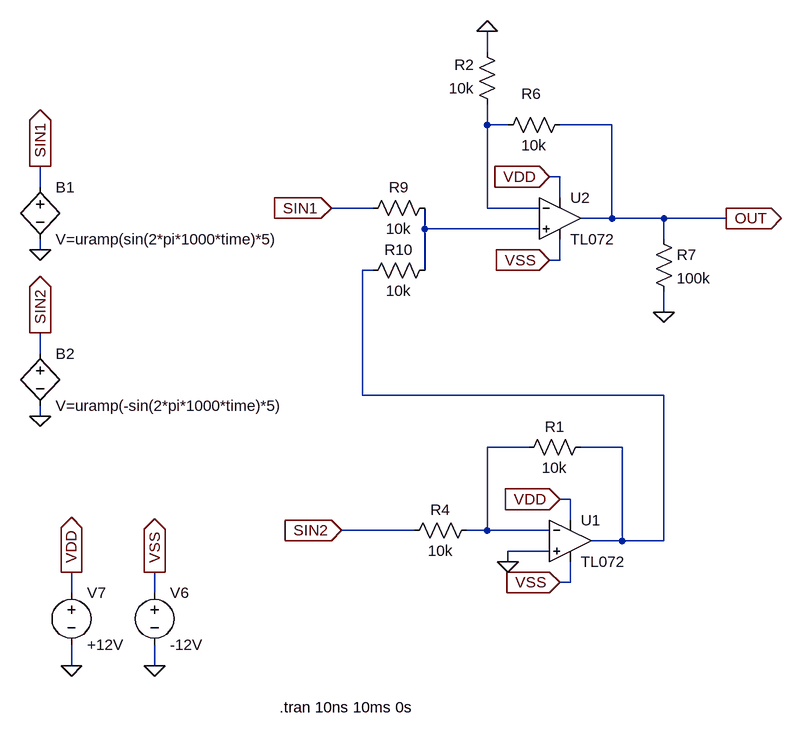
[diagram p0: schematic phr-eurpi-ext-p-p-inv-n-sum-non-inv.asc]
phr-eurpi-ext-p-p-inv-n-sum-non-inv.asc, the LTspice schematic file:
Version 4
SHEET 1 1100 680
WIRE 336 -512 336 -544
WIRE 336 -400 336 -432
WIRE 368 -400 336 -400
WIRE 528 -400 448 -400
WIRE 448 -320 432 -320
WIRE -352 -304 -352 -336
WIRE 448 -288 448 -320
WIRE 160 -272 96 -272
WIRE 336 -272 336 -400
WIRE 416 -272 336 -272
WIRE 528 -256 528 -400
WIRE 528 -256 480 -256
WIRE 608 -256 528 -256
WIRE 704 -256 608 -256
WIRE 240 -240 240 -272
WIRE 416 -240 240 -240
WIRE 608 -224 608 -256
WIRE -352 -208 -352 -224
WIRE 448 -192 448 -224
WIRE 448 -192 432 -192
WIRE 160 -176 144 -176
WIRE 240 -176 240 -240
WIRE 608 -112 608 -144
WIRE -352 -48 -352 -80
WIRE 144 16 144 -176
WIRE 608 16 144 16
WIRE -352 48 -352 32
WIRE 400 96 336 96
WIRE 544 96 480 96
WIRE 464 176 448 176
WIRE 464 208 464 176
WIRE 224 224 112 224
WIRE 336 224 336 96
WIRE 336 224 304 224
WIRE 432 224 336 224
WIRE 544 240 544 96
WIRE 544 240 496 240
WIRE 608 240 608 16
WIRE 608 240 544 240
WIRE 432 256 368 256
WIRE 368 272 368 256
WIRE 464 304 464 272
WIRE 464 304 448 304
WIRE -304 320 -304 288
WIRE -176 320 -176 288
WIRE -304 432 -304 400
WIRE -176 432 -176 400
FLAG -176 432 0
FLAG -304 432 0
FLAG 448 304 VSS
IOPIN 448 304 In
FLAG 448 176 VDD
IOPIN 448 176 In
FLAG -304 288 VDD
IOPIN -304 288 Out
FLAG -176 288 VSS
IOPIN -176 288 Out
FLAG 704 -256 OUT
IOPIN 704 -256 Out
FLAG 608 -112 0
FLAG 432 -192 VSS
IOPIN 432 -192 In
FLAG 432 -320 VDD
IOPIN 432 -320 In
FLAG 336 -544 0
FLAG -352 -336 SIN1
IOPIN -352 -336 Out
FLAG -352 -80 SIN2
IOPIN -352 -80 Out
FLAG 96 -272 SIN1
IOPIN 96 -272 In
FLAG 112 224 SIN2
IOPIN 112 224 In
FLAG -352 48 0
FLAG -352 -208 0
FLAG 368 272 0
SYMBOL TL072 464 176 R0
SYMATTR InstName U1
SYMBOL Res 320 208 R90
WINDOW 0 0 56 VBottom 2
WINDOW 3 32 56 VTop 2
SYMATTR InstName R4
SYMATTR Value 10k
SYMBOL Voltage -176 304 R0
SYMATTR InstName V6
SYMATTR Value -12V
SYMBOL Voltage -304 304 R0
SYMATTR InstName V7
SYMATTR Value +12V
SYMBOL TL072 448 -320 R0
SYMATTR InstName U2
SYMBOL Res 592 -240 R0
SYMATTR InstName R7
SYMATTR Value 100k
SYMBOL Res 464 -416 R90
WINDOW 0 -16 60 VBottom 2
WINDOW 3 32 56 VTop 2
SYMATTR InstName R6
SYMATTR Value 10k
SYMBOL Res 256 -288 R90
WINDOW 0 0 56 VBottom 2
WINDOW 3 32 56 VTop 2
SYMATTR InstName R9
SYMATTR Value 10k
SYMBOL Res 256 -192 R90
WINDOW 0 0 56 VBottom 2
WINDOW 3 32 56 VTop 2
SYMATTR InstName R10
SYMATTR Value 10k
SYMBOL Res 496 80 R90
WINDOW 0 0 56 VBottom 2
WINDOW 3 32 56 VTop 2
SYMATTR InstName R1
SYMATTR Value 10k
SYMBOL bv -352 -320 R0
SYMATTR InstName B1
SYMATTR Value V=uramp(sin(2*pi*1000*time)*5)
SYMBOL bv -352 -64 R0
SYMATTR InstName B2
SYMATTR Value V=uramp(-sin(2*pi*1000*time)*5)
SYMBOL Res 352 -416 R180
WINDOW 0 36 76 Left 2
WINDOW 3 36 40 Left 2
SYMATTR InstName R2
SYMATTR Value 10k
TEXT 16 496 Left 2 !.tran 10ns 10ms 0s

The netlist it stands for:
* phr-eurpi-ext-p-p-inv-n-sum-non-inv.asc
* U1: TL072 (symbol TL072 not available, pins judged from their places): In+=0 In-=N004 V+=VDD V-=VSS OUT=N003
R4 N004 SIN2 10k
V6 VSS 0 -12V
V7 VDD 0 +12V
* U2: TL072 (symbol TL072 not available, pins judged from their places): In+=N002 In-=N001 V+=VDD V-=VSS OUT=OUT
R7 OUT 0 100k
R6 OUT N001 10k
R9 N002 SIN1 10k
R10 N002 N003 10k
R1 N003 N004 10k
B1 SIN1 0 V=uramp(sin(2*pi*1000*time)*5)
B2 SIN2 0 V=uramp(-sin(2*pi*1000*time)*5)
R2 N001 0 10k
.tran 10ns 10ms 0s
.backanno
.end